# EAGLE design Frame2TTL_v3_1 (EAGLE 9.6.2)
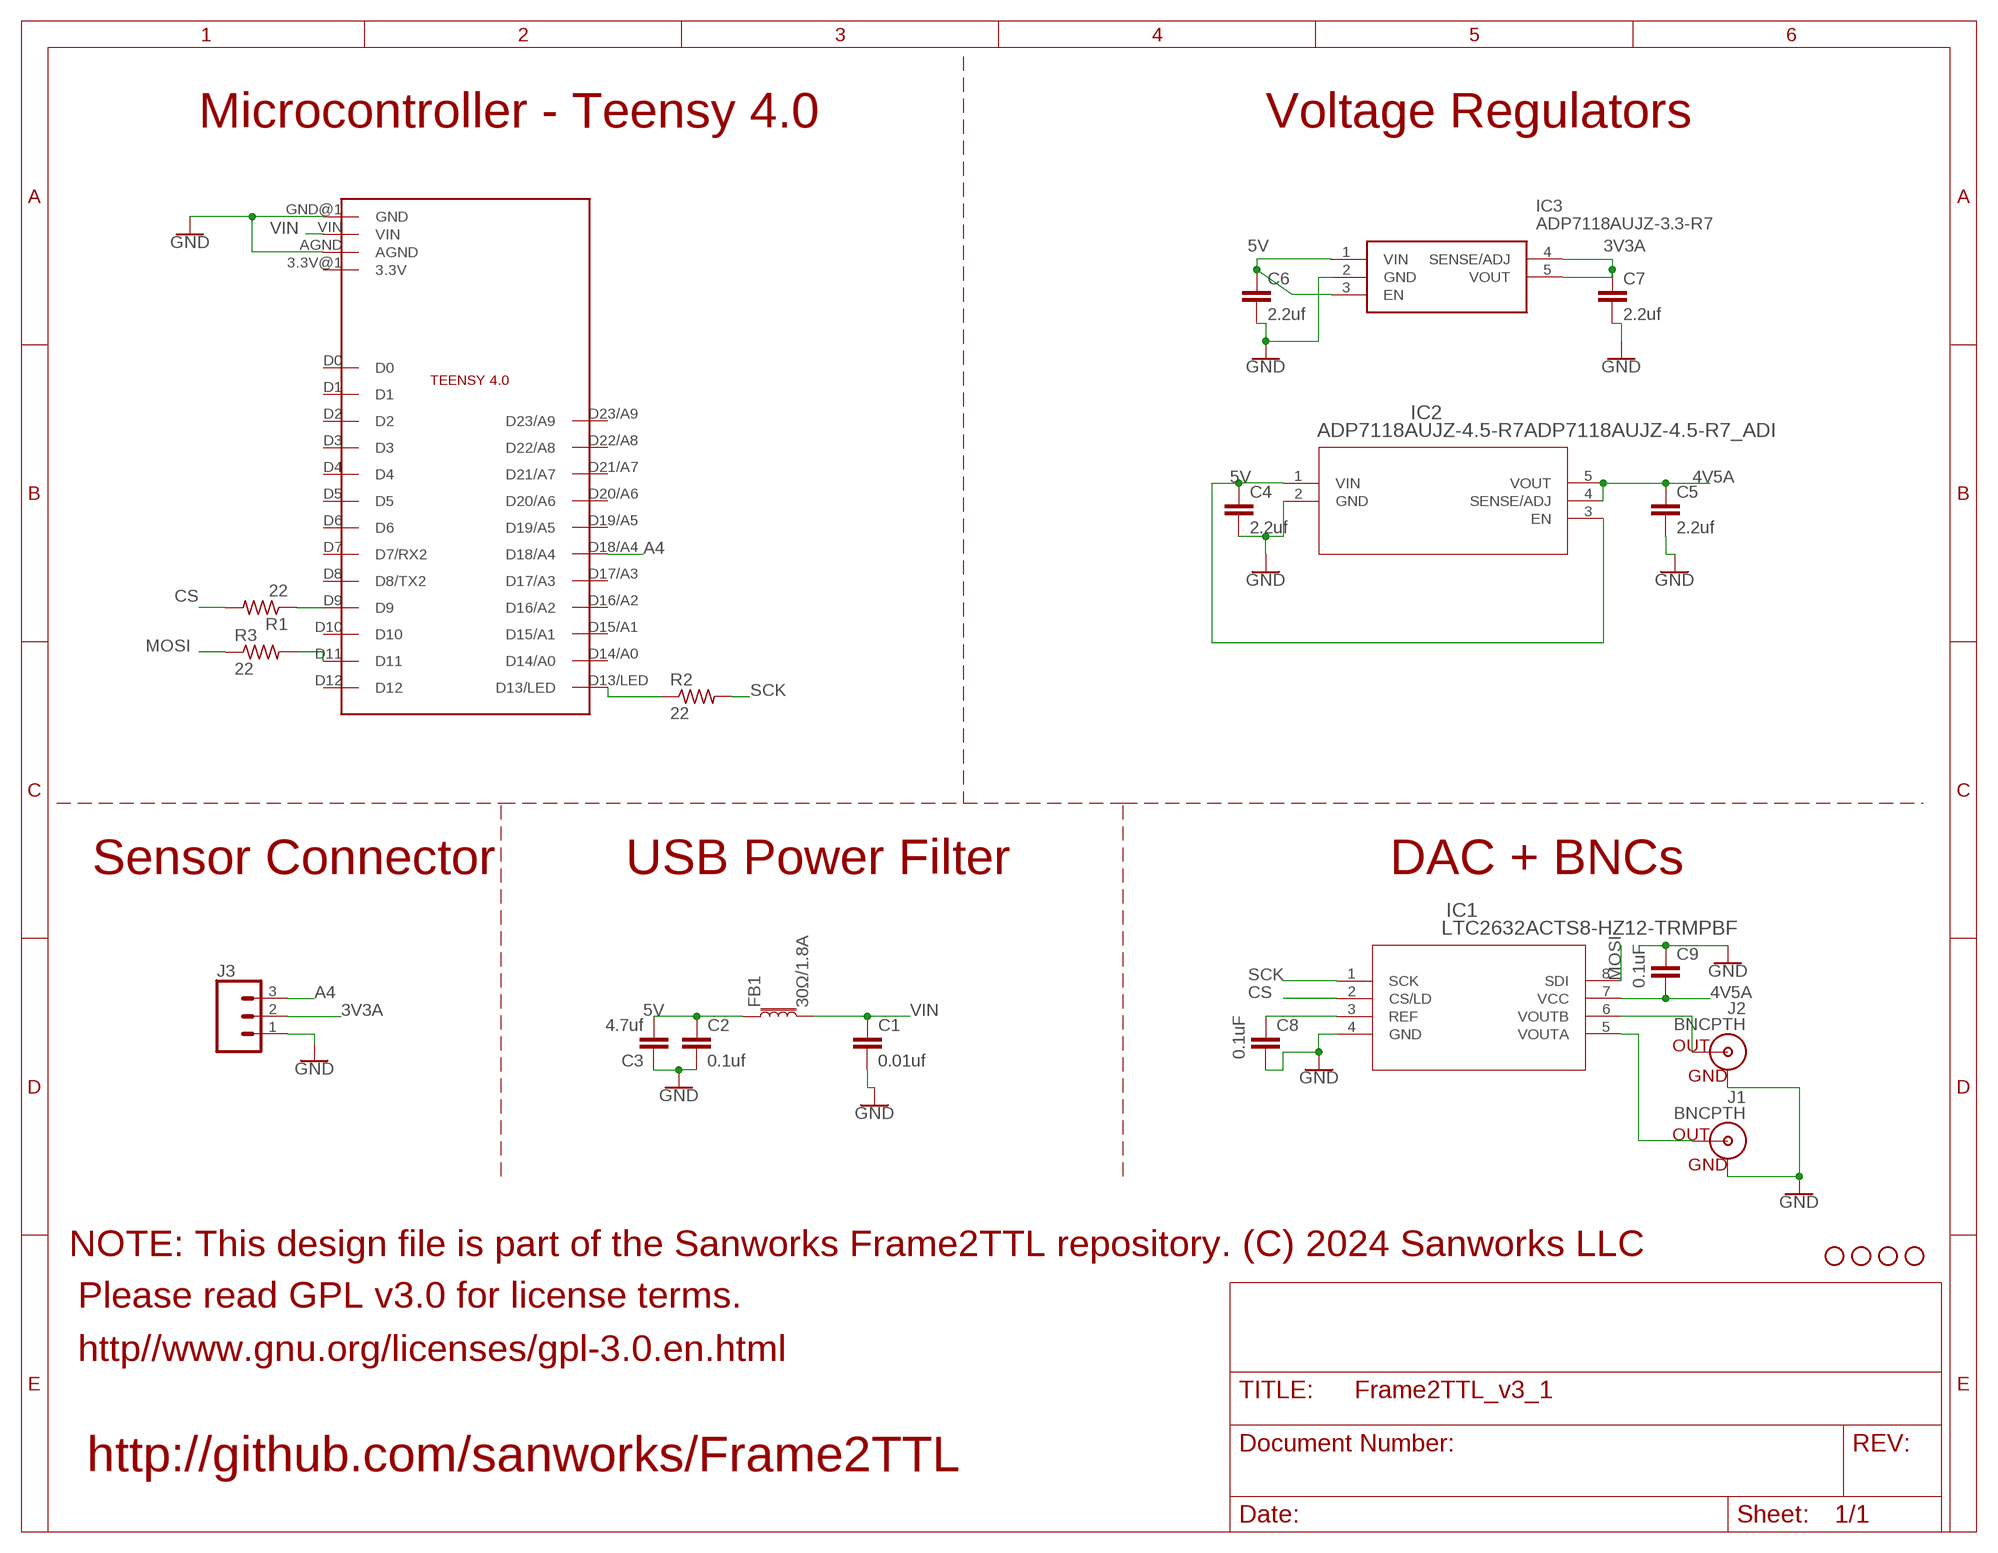
[diagram p0: schematic, sheet 1]

## Parts
C1  0.01uf  10UF-0805-10V-10%  [0805]
C2  0.1uf  10UF-0805-10V-10%  [0805]
C3  4.7uf  CAP1206  [1206@2]
C4  2.2uf  1.0UF-0805-25V-10%  [0805]
C5  2.2uf  1.0UF-0805-25V-10%  [0805]
C6  2.2uf  1.0UF-0805-25V-10%  [0805]
C7  2.2uf  1.0UF-0805-25V-10%  [0805]
C8  0.1uF  1.0UF-0805-25V-10%  [0805]
C9  0.1uF  1.0UF-0805-25V-10%  [0805]
FB1  30Ω/1.8A  FERRITE_BEAD-0603  [0603]
H1  STAND-OFF  [STAND-OFF]
H2  STAND-OFF  [STAND-OFF]
H3  STAND-OFF  [STAND-OFF]
H4  STAND-OFF  [STAND-OFF]
IC1  LTC2632ACTS8-HZ12-TRMPBF  LTC2632AHTS8-LI12TRMPBF  [TSOT-23-8_1P625X2P9_ADI]
IC2  ADP7118AUJZ-4.5-R7ADP7118AUJZ-4.5-R7_ADI  [ADP7118AUJZ-4.5-R7_ADI]
IC3  ADP7118AUJZ-3.3-R7  [SOT95P280X100-5N]
J1  BNCPTH  [BNC]
J2  BNCPTH  [BNC]
J3  CONN_03LOCK  [1X03_LOCK]
MC1  TEENSY4.0_SIMPLE_NO_VUSB  [TEENSY4.0_SIMPLE_NO_VUSB]
R1  22  R-US_R0805  [R0805]
R2  22  R-US_R0805  [R0805]
R3  22  R-US_R0805  [R0805]

## Nets
3V3A: C7.1 IC3.4(SENSE/ADJ) IC3.5(VOUT) J3.2
4V5A: C5.1 C9.2 IC1.7(VCC) IC2.4(SENSE/ADJ) IC2.5(VOUT)
5V: C2.1 C3.2 C4.1 C6.1 FB1.1 IC2.1(VIN) IC2.3(EN) IC3.1(VIN) IC3.3(EN)
A4: J3.3 MC1.D18/A4
CS: IC1.2(CS/LD) R1.2
GND: C1.2 C2.2 C3.1 C4.2 C5.2 C6.2 C7.2 C8.2 C9.1 IC1.4(GND) IC2.2(GND) IC3.2(GND) J1.GND J2.GND J3.1 MC1.AGND MC1.GND@1(GND)
MOSI: IC1.8(SDI) R3.1
N$1: MC1.D11 R3.2
N$2: MC1.D9 R1.1
N$3: MC1.D13/LED R2.1
N$8: IC1.5(VOUTA) J1.S(OUT)
N$9: IC1.6(VOUTB) J2.S(OUT)
N$10: C8.1 IC1.3(REF)
SCK: IC1.1(SCK) R2.2
VIN: C1.1 FB1.2 MC1.VIN
Unconnected: MC1.3.3V@1(3.3V) MC1.D0 MC1.D1 MC1.D2 MC1.D3 MC1.D4 MC1.D5 MC1.D6 MC1.D7(D7/RX2) MC1.D8(D8/TX2) MC1.D10 MC1.D12 MC1.D14/A0 MC1.D15/A1 MC1.D16/A2 MC1.D17/A3 MC1.D19/A5 MC1.D20/A6 MC1.D21/A7 MC1.D22/A8 MC1.D23/A9

## Notes on the sheet
- Microcontroller - Teensy 4.0 | Voltage Regulators
- Sensor Connector | USB Power Filter | DAC + BNCs
- NOTE: This design file is part of the Sanworks Frame2TTL repository. (C) 2024 Sanworks LLC
- Please read GPL v3.0 for license terms.
- http//www.gnu.org/licenses/gpl-3.0.en.html
- http://github.com/sanworks/Frame2TTL

## Library data of the parts
C1 C2 = SparkFun-Capacitors:10UF: 10.0µF ceramic capacitors A capacitor is a passive two-terminal electrical component used to store electrical energy temporarily in an electric field.; PROD_ID: CAP-11330; VALUE: 10uF
C3 = SparkFun-Capacitors:CAP: Capacitor Standard 0603 ceramic capacitor, and 0.1" leaded capacitor.
C4-C9 = SparkFun-Capacitors:1.0UF: 1µF ceramic capacitors A capacitor is a passive two-terminal electrical component used to store electrical energy temporarily in an electric field.; PROD_ID: CAP-08064; VALUE: 1.0uF
FB1 = SparkFun-Coils:FERRITE_BEAD: Ferrite Bead (blocks, cores, rings, chokes, etc.) Inductor with layers of ferrite used to suppress high frequencies. Often used to isolate high frequency noise. SparkFun Products: IOIO-OTG - V2.2 <https://www.sparkfun.com/products/13613> SparkFun SAMD21 Mini Breakout <https://www.sparkfun.com/products/13664> SparkFun 6 Degrees of Freedom Breakout - LSM6DS3 <https://www.sparkfun.com/products/13339> SparkFun SAMD21 Dev Breakout <https://www.sparkfun.com/products/13672>; PROD_ID: NDUC-13805
H1-H4 = SparkFun-Hardware:STAND-OFF: Stand Off Drill holes for mechanically mounting via screws, standoffs, etc. Note: Use the keepout ring to avoid running the screw head into surrounding components. Variant Overviews STAND-OFF - Mechanical footprint for a #4 phillips button head screw. STAND-OFF-TIGHT - Mechanical footprint for a #4 phillips button head screw, Example SparkFun Products Screw - Phillips Head (1/4", 4-40, 10 pack) <https://www.sparkfun.com/products/10453> (PRT-10453) Screw - Phillips Head (1/2", 4-40, 10 pack) <https://www.sparkfun.com/products/10452> (PRT-10452) Screw - Phillips Head (3/4", 4-40, 10 pack) <https://www.sparkfun.com/products/10451> (PRT-10451) Screw - Phillips Head (1", 4-40, 10 pack) <https://www.sparkfun.com/products/10450> (PRT-10450)
IC1 = LTC2632:LTC2632AHTS8-LI12TRMPBF; COPYRIGHT: Copyright (C) 2022 Ultra Librarian. All rights reserved.; MANUFACTURER_PART_NUMBER: LTC2632AHTS8-LI12#TRMPBF; MFR_NAME: Analog Devices Inc
IC2 = 2023-05-29_01-50-32_Library:ADP7118AUJZ-4.5-R7; COPYRIGHT: Copyright (C) 2023 Ultra Librarian. All rights reserved.; MANUFACTURER_PART_NUMBER: ADP7118AUJZ-4.5-R7; MFR_NAME: Analog Devices Inc
IC3 = ADP7118AUJZ-3.3-R7:ADP7118AUJZ-3.3-R7: LDO Regulator Pos 3.3V 0.2A 5-Pin TSOT-23 T/R Source: Datasheet <http://www.analog.com/media/en/technical-documentation/data-sheets/ADP7118.pdf>; DESCRIPTION: LDO Regulator Pos 3.3V 0.2A 5-Pin TSOT-23 T/R; HEIGHT: 1mm; MANUFACTURER_NAME: Analog Devices; MANUFACTURER_PART_NUMBER: ADP7118AUJZ-3.3-R7; MOUSER_PART_NUMBER: 584-ADP7118AUJZ3.3R7; MOUSER_PRICE-STOCK: https://www.mouser.co.uk/ProductDetail/Analog-Devices/ADP7118AUJZ-3.3-R7?qs=hpwIUhX6lWxSxNRE9lKdtQ%3D%3D
J1 J2 = SparkFun-Connectors:BNC: BNC Right Angle Connector Mouser Part# 5227161 SparkFun Products: BNC Connector - Right Angle <https://www.sparkfun.com/products/10550>; PROD_ID: LPA-12729; SF_ID: PRT-10550
J3 = SparkFun-Connectors:CONN_03: Multi connection point. Often used as Generic Header-pin footprint for 0.1 inch spaced/style header connections On any of the 0.1 inch spaced packages, you can populate with these: Break Away Headers - Straight <https://www.sparkfun.com/products/116> (PRT-00116) Break Away Male Headers - Right Angle <https://www.sparkfun.com/products/553> (PRT-00553) Female Headers <https://www.sparkfun.com/products/115> (PRT-00115) Break Away Headers - Machine Pin <https://www.sparkfun.com/products/117> (PRT-00117) Break Away Female Headers - Swiss Machine Pin <https://www.sparkfun.com/products/743> (PRT-00743) Stackable Header - 3 Pin (Female, 0.1") <https://www.sparkfun.com/products/13875> (PRT-13875) For SCREWTERMINALS and SPRING TERMINALS visit here: Screw Terimnals on SparkFun.com <https://www.sparkfun.com/search/results?term=Screw+Terminals> (5mm/3.5mm/2.54mm spacing) This device is also useful as a general connection point to wire up your design to another part of your project. Our various solder wires solder well into these plated through hole pads. Hook-Up Wire - Assortment (Stranded, 22 AWG) <https://www.sparkfun.com/products/11375> (PRT-11375) Hook-Up Wire - Assortment (Solid Core, 22 AWG) <https://www.sparkfun.com/products/11367> (PRT-11367) View the entire wire category on our website here <https://www.sparkfun.com/categories/141> Special notes: Molex polarized connector foot print use with SKU : PRT-08232 with associated crimp pins and housings.
MC1 = Teensy4.0_SIMPLE_N_VUSB:TEENSY4.0_SIMPLE_NO_VUSB: Tennsy 4.0 simple layout (no underside pins or VUSB )
R1-R3 = adafruit:R-US_: RESISTOR, American symbol

## Board
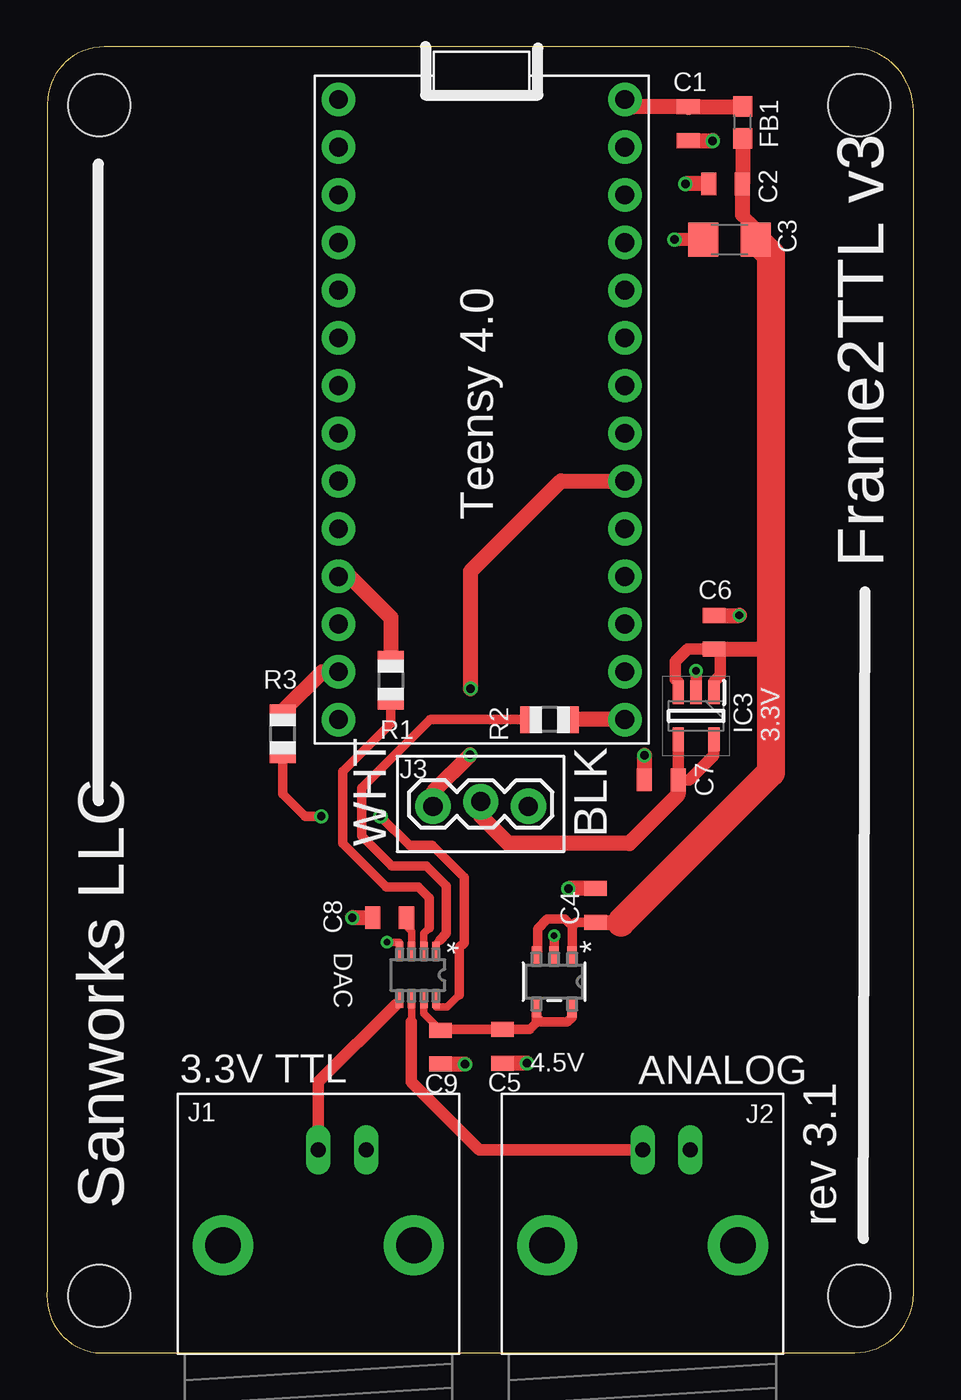
[diagram p1: board, top side]
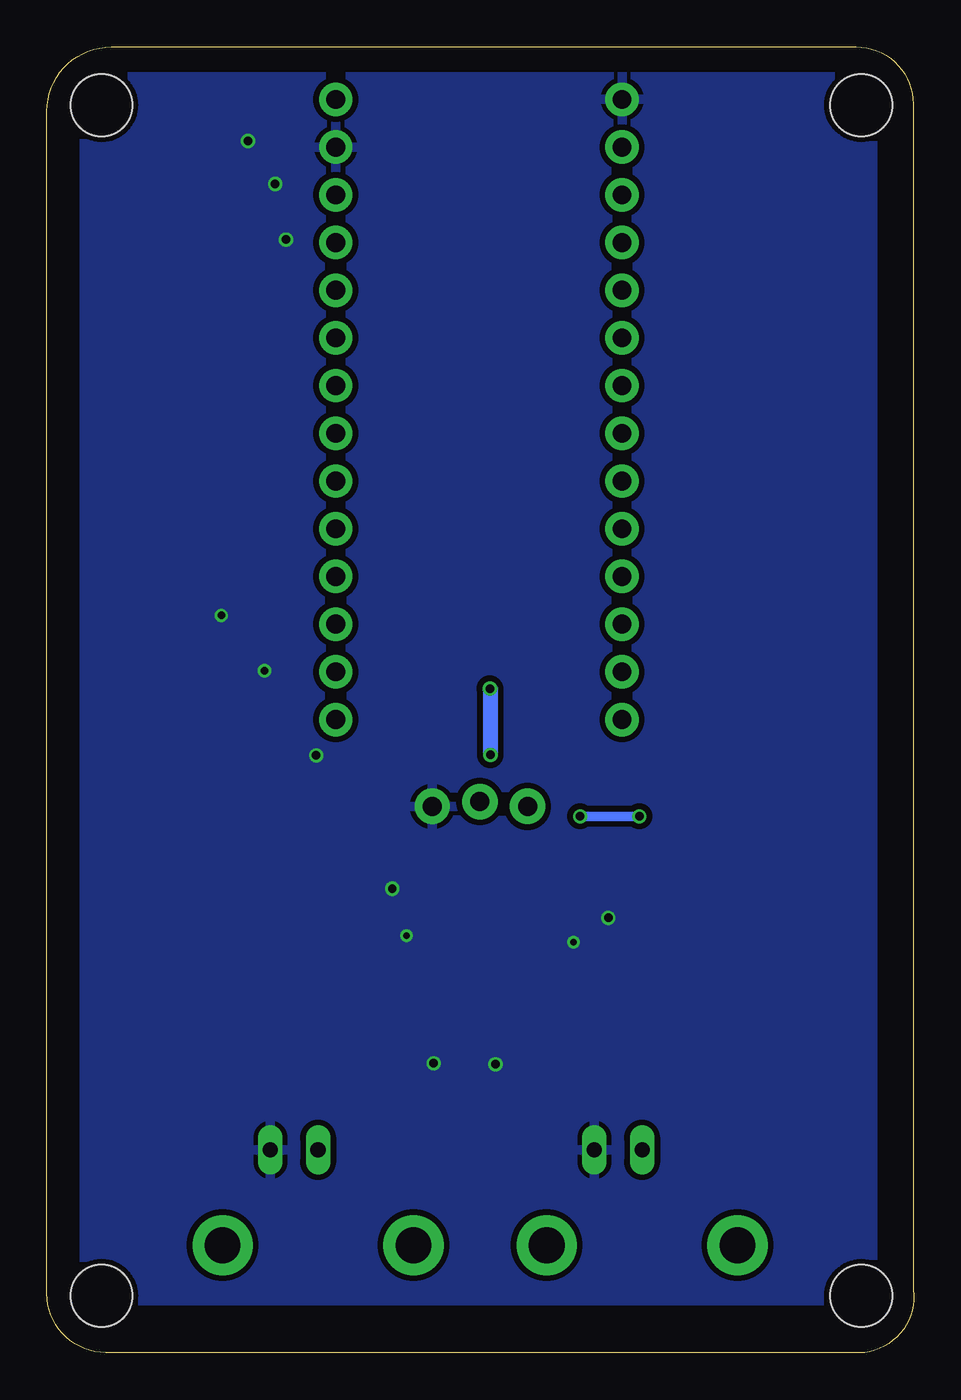
[diagram p2: board, bottom side, seen from below]

Size 46.13 x 69.52 mm. Coordinates in mm from the lower left corner, seen from the top.
Outline: 2.59,0 43,0 arc90 46.13,3.13 46.13,66.11 arc90 42.72,69.52 3.05,69.52 arc90 0.02,66.49 0.02,3.33 arc90 2.59,0
Copper layers (1*16): Top 0.035mm / dielectric 1.5mm / Bottom 0.035mm
Design rules "SeeedStudio_2layer_DRU_no_angle_20140221 *": minimum track width 12mil, minimum drill 12mil, track to track 12mil, track to pad 12mil, pad to pad 12mil, via to via 12mil, smd to smd 0mil, copper to edge 10mil, drill to drill 10mil, minimum pad ring 10mil, minimum via ring 6mil, stop-mask expansion 2mil, vias tented up to drill 100mil, thermal gap 10mil

### Footprints (pad centres in the part's own frame; a part is rotated, then mirrored left to right if it is on the bottom)
0805 = smd 0.8 x 1.2: 1 -0.9,0; 2 0.9,0
1206@2 = smd 1.6 x 1.8: 1 -1.4,0; 2 1.4,0
0603 = smd 1.1 x 1: 1 -0.85,0; 2 0.85,0
STAND-OFF = hole 3.302: 0,0
TSOT-23-8_1P625X2P9_ADI = smd 0.94 x 0.406: 1 -1.283,0.975; 2 -1.283,0.325; 3 -1.283,-0.325; 4 -1.283,-0.975; 5 1.283,-0.975; 6 1.283,-0.325; 7 1.283,0.325; 8 1.283,0.975
ADP7118AUJZ-4.5-R7_ADI = smd 1.003 x 0.508: 1 -1.378,0.95; 2 -1.378,0; 3 -1.378,-0.95; 4 1.378,-0.95; 5 1.378,0.95
SOT95P280X100-5N = smd 1.25 x 0.6: 1 -1.25,0.95; 2 -1.25,0; 3 -1.25,-0.95; 4 1.25,-0.95; 5 1.25,0.95
BNC = drill 1.9 pad 3.2: 3 -5.08,5.08; 4 5.08,5.08 | drill 0.8 long: GND -2.54,0; S 0,0
1X03_LOCK = drill 1.016 pad 1.88: 1 0,0.127; 2 2.54,-0.127; 3 5.08,0.127
TEENSY4.0_SIMPLE_NO_VUSB = drill 1 pad 1.778: 3.3V@1 7.62,10.16; AGND 7.62,12.7; D0 -7.62,12.7; D1 -7.62,10.16; D2 -7.62,7.62; D3 -7.62,5.08; D4 -7.62,2.54; D5 -7.62,0; D6 -7.62,-2.54; D7 -7.62,-5.08; D8 -7.62,-7.62; D9 -7.62,-10.16; D10 -7.62,-12.7; D11 -7.62,-15.24; D12 -7.62,-17.78; D13/LED 7.62,-17.78; D14/A0 7.62,-15.24; D15/A1 7.62,-12.7; D16/A2 7.62,-10.16; D17/A3 7.62,-7.62; D18/A4 7.62,-5.08; D19/A5 7.62,-2.54; D20/A6 7.62,0; D21/A7 7.62,2.54; D22/A8 7.62,5.08; D23/A9 7.62,7.62; GND@1 -7.62,15.24; VIN 7.62,15.24
R0805 = smd 1.1 x 1.4: 1 -1,0; 2 1,0

### Placement (x,y rotation side)
C1  34.13,65.43 270 top
C2  36.12,62.23 180 top
C3  36.33,59.26 0 top
C4  29.2,23.8 90 top
C5  24.25,16.3 270 top
C6  35.5,38.35 90 top
C7  32.7,30.5 180 top
C8  18.24,23.15 180 top
C9  20.95,16.27 90 top
FB1  37.03,65.51 90 top
H1  43.23,66.42 0 top
H2  2.79,66.42 0 top
H3  43.23,3.02 0 top
H4  2.79,3.02 0 top
IC1  19.74,20.1 270 top
IC2  27,19.75 270 top
IC3  34.55,33.9 270 top
J1  14.45,10.79 180 top
J2  31.7,10.79 180 top
J3  25.63,29.21 180 top
MC1  23.14,51.49 0 top
R1  18.3,35.8 270 top
R2  26.75,33.7 180 top
R3  12.55,32.95 90 top

### Tracks (layer width: path | path; a pad name or v marks a point on that pad's centre or on a via)
3V3A
  Top 0.6: IC3.5 35.5,31.8 34.2,30.5 C7.1 IC3.4
  Top 0.8: C7.1 33.6,29.7 31,27.1 24.55,27.1 23.09,28.56 J3.2
4V5A
  Top 0.4: IC1.7 20.06,18.06 C9.2
  Top 0.5: IC2.5 27.95,17.85 27.7,17.6 26.3,17.6 26.05,17.85 | 26.05,17.85 IC2.4 | 26.05,17.85 26.05,17.55 25.7,17.2 C5.1 20.99,17.2 C9.2
5V
  Top 0.5: 27.95,22.7 IC2.1 | IC2.3 26.12,21.2 26.12,22.57 26.63,23.08 27.57,23.08 27.95,22.7 | C4.1 28.15,22.9 27.95,22.7
  Top 0.6: IC3.3 33.6,35.7 33.45,35.85 33.45,36.8 34.1,37.45 C6.1 | IC3.1 35.5,35.7 35.85,36.05 35.85,37.45
  Top 0.7: 37.03,62.24 C2.1 | C3.2 37.73,59.86 37.02,60.57
  Top 0.8: FB1.1 37.03,62.24 | C2.1 37.02,60.57 | C4.1 30.55,22.9 | C6.1 35.85,37.45 38.53,37.45
  Top 1.5: C3.2 38.53,58.46 38.53,37.45 38.53,30.88 30.55,22.9
A4  (via drill 0.45)
  Top 0.8: J3.3 20.55,29.85 v22.52,31.83 | v22.55,35.35 22.55,41.6 27.35,46.41 MC1.D18/A4
  Bottom 0.8: v22.55,35.35 22.52,35.33 v22.52,31.83
CS
  Top 0.4: IC1.2 20.06,22.31 20.35,22.6
  Top 0.5: 20.35,22.6 20.35,24.2 19.75,24.8 18.05,24.8 15.75,27.1 15.75,30.95 18.3,33.5 R1.2
GND  (via drill 0.35, 0.4, 0.45)
  Top 0.4: IC1.4 18.76,21.85 v18.1,21.85
  Top 0.5: IC2.2 v27,22.2
  Top 0.6: v16.25,23.15 | IC3.2 v34.55,36.3
  Top 0.7: 35.42,64.53 v35.43,64.52 | C3.1 v33.41,59.26 | v33.41,59.26
  Top 0.8: C1.2 35.42,64.53 | C2.2 v33.98,62.23 | C9.1 22.23,15.37 v22.25,15.35 | C8.2 v16.25,23.15 | C4.2 v27.75,24.7 | v25.55,15.4 C5.2 | C6.2 v36.85,39.25 | v31.8,31.8 C7.2
  pour Bottom: 2.18,67.94 2.18,2.74 44.14,2.74 44.14,67.94
MOSI  (via drill 0.45)
  Top 0.4: IC1.8 20.71,18.4 21.3,18.4 21.95,19.05
  Top 0.5: R3.1 12.55,29.75 13.75,28.55 v14.6,28.55 | v17.75,28.55 19.3,27 20.5,27 22.21,25.29 22.21,21.82 21.95,21.56 21.95,19.05
  Bottom 0.5: v14.6,28.55 v17.75,28.55
N$1
  Top 0.8: MC1.D11 14.64,36.25 12.55,34.15 R3.2
N$2
  Top 0.8: MC1.D9 16.12,41.33 18.3,39.15 R1.1
N$3
  Top 0.8: MC1.D13/LED R2.1
N$8
  Top 0.4: IC1.5 18.76,18.71 18.6,18.55
  Top 0.6: J1.S 14.45,14.4 18.6,18.55
N$9
  Top 0.4: IC1.6 19.41,17.61 19.4,17.6
  Top 0.6: 19.4,17.6 19.4,14.4 23.01,10.79 J2.S
N$10
  Top 0.4: IC1.3 19.41,22.43 19.14,22.7 C8.1
SCK
  Top 0.4: IC1.1 20.71,21.76 20.9,21.95
  Top 0.5: R2.2 20.4,33.7 16.75,30.05 16.75,27.5 18.35,25.9 20.2,25.9 21.25,24.85 21.25,22.31 20.9,21.95
VIN
  Top 0.8: MC1.VIN 31.15,66.33 C1.1 34.16,66.31 36.98,66.31 FB1.2

### Text on the board
tPlace: Teensy 4.0 | Frame2TTL v3 | 3.3V | WHT | BLK | DAC | 4.5V | 3.3V TTL | ANALOG | Sanworks LLC | rev 3.1